# EAGLE schematic SwitchMult (EAGLE 6.6.0)
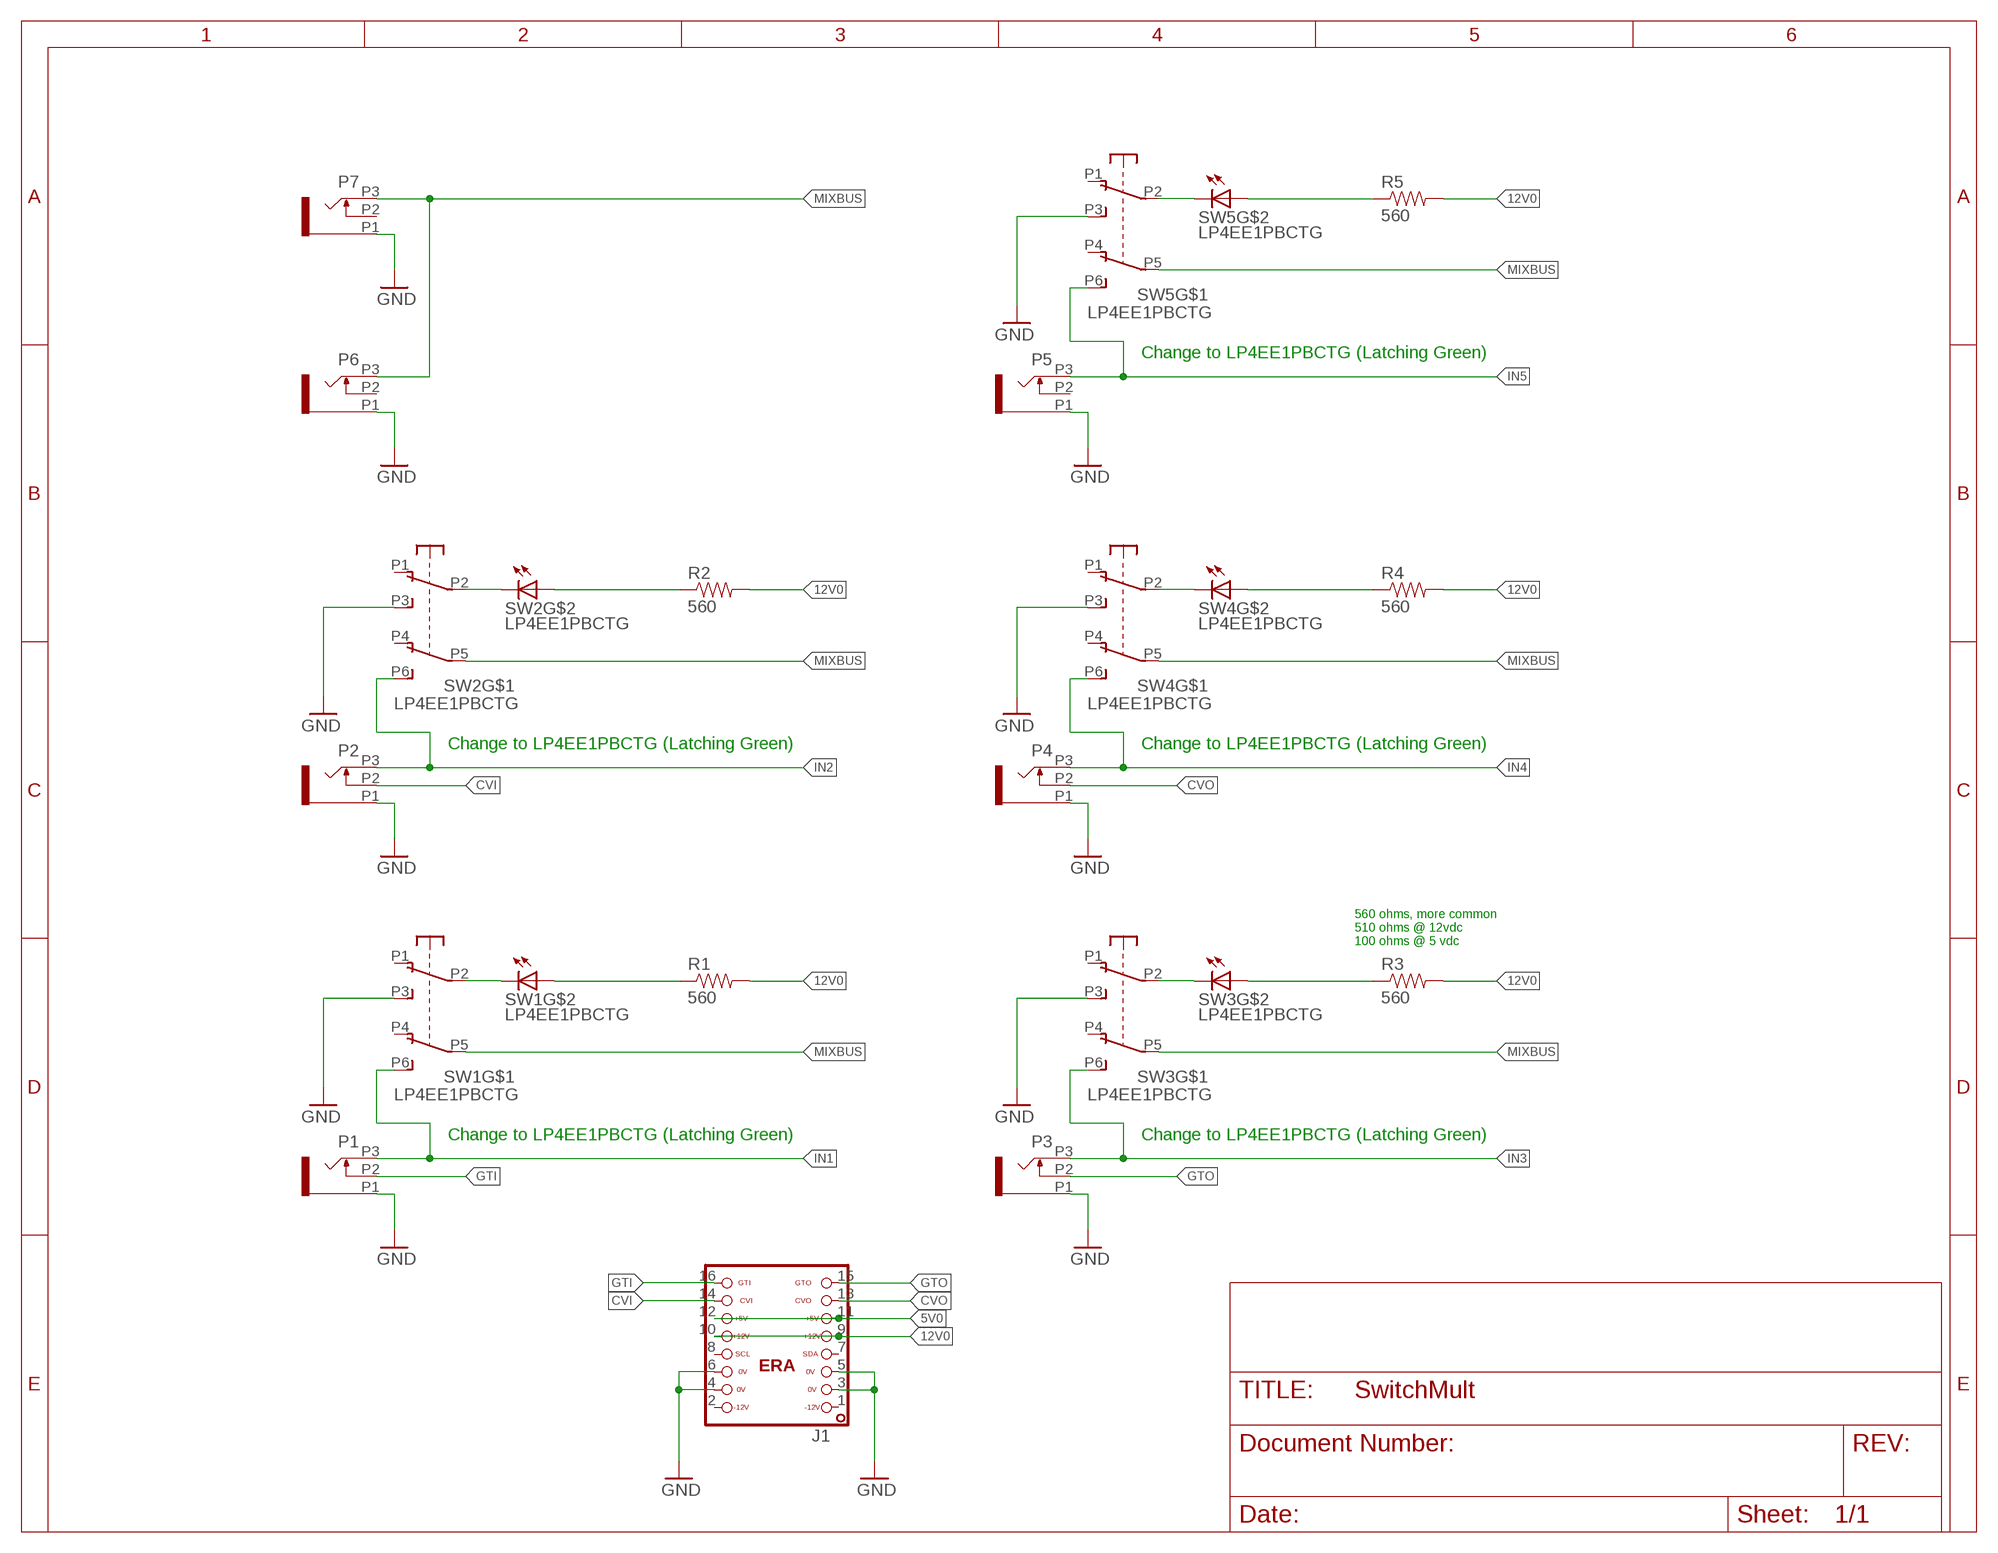
[diagram p0: schematic, sheet 1]

## Parts
J1  ERA-SHROUD  [ERA]
P1  PJ301_THONKICONN6  [WQP_PJ_301M6]
P2  PJ301_THONKICONN6  [WQP_PJ_301M6]
P3  PJ301_THONKICONN6  [WQP_PJ_301M6]
P4  PJ301_THONKICONN6  [WQP_PJ_301M6]
P5  PJ301_THONKICONN6  [WQP_PJ_301M6]
P6  PJ301_THONKICONN6  [WQP_PJ_301M6]
P7  PJ301_THONKICONN6  [WQP_PJ_301M6]
R1  560  RESISTORPTH-1/4W  [AXIAL-0.4]
R2  560  RESISTORPTH-1/4W  [AXIAL-0.4]
R3  560  RESISTORPTH-1/4W  [AXIAL-0.4]
R4  560  RESISTORPTH-1/4W  [AXIAL-0.4]
R5  560  RESISTORPTH-1/4W  [AXIAL-0.4]
SW1  LP4EE1PBCTG  LP4OA1PBCT  [LP4OA1PBCT]
SW2  LP4EE1PBCTG  LP4OA1PBCT  [LP4OA1PBCT]
SW3  LP4EE1PBCTG  LP4OA1PBCT  [LP4OA1PBCT]
SW4  LP4EE1PBCTG  LP4OA1PBCT  [LP4OA1PBCT]
SW5  LP4EE1PBCTG  LP4OA1PBCT  [LP4OA1PBCT]

## Nets
5V0: J1.11 J1.12
12V0: J1.9 J1.10 R1.P$2 R2.P$2 R3.P$2 R4.P$2 R5.P$2
CVI: J1.14 P2.P2
CVO: J1.13 P4.P2
GND: J1.3 J1.4 J1.5 J1.6 P1.P1 P2.P1 P3.P1 P4.P1 P5.P1 P6.P1 P7.P1 SW1.P3(A3) SW2.P3(A3) SW3.P3(A3) SW4.P3(A3) SW5.P3(A3)
GTI: J1.16 P1.P2
GTO: J1.15 P3.P2
IN1: P1.P3 SW1.P6(B3)
IN2: P2.P3 SW2.P6(B3)
IN3: P3.P3 SW3.P6(B3)
IN4: P4.P3 SW4.P6(B3)
IN5: P5.P3 SW5.P6(B3)
MIXBUS: P6.P3 P7.P3 SW1.P5(B2) SW2.P5(B2) SW3.P5(B2) SW4.P5(B2) SW5.P5(B2)
N$1: SW1.L2 SW1.P2(A2)
N$2: SW2.L2 SW2.P2(A2)
N$3: R1.P$1 SW1.L1
N$4: R2.P$1 SW2.L1
N$5: SW3.L2 SW3.P2(A2)
N$6: R3.P$1 SW3.L1
N$7: SW4.L2 SW4.P2(A2)
N$8: R4.P$1 SW4.L1
N$9: SW5.L2 SW5.P2(A2)
N$10: R5.P$1 SW5.L1
Unconnected: J1.1 J1.2 J1.7 J1.8 P5.P2 P6.P2 P7.P2 SW1.P1(A1) SW1.P4(B1) SW2.P1(A1) SW2.P4(B1) SW3.P1(A1) SW3.P4(B1) SW4.P1(A1) SW4.P4(B1) SW5.P1(A1) SW5.P4(B1)

## Notes on the sheet
- Change to LP4EE1PBCTG (Latching Green)
- Change to LP4EE1PBCTG (Latching Green) | Change to LP4EE1PBCTG (Latching Green)
- 560 ohms, more common
  510 ohms @ 12vdc
  100 ohms @ 5 vdc
- Change to LP4EE1PBCTG (Latching Green) | Change to LP4EE1PBCTG (Latching Green)

## Library data of the parts
J1 = ERA:ERA: EuroRack2 - Backplane Connector
P1-P7 = og-pj301:PJ301_THONKICONN
R1-R5 = halcyonmod_Passives:RESISTOR: Resistor Basic schematic elements and footprints for 0603, 1206, and PTH resistors.
SW1-SW5 = og-switch:LP4OA1PBCT